# EAGLE board navigator (EAGLE 8.2.0), part 1 of 2
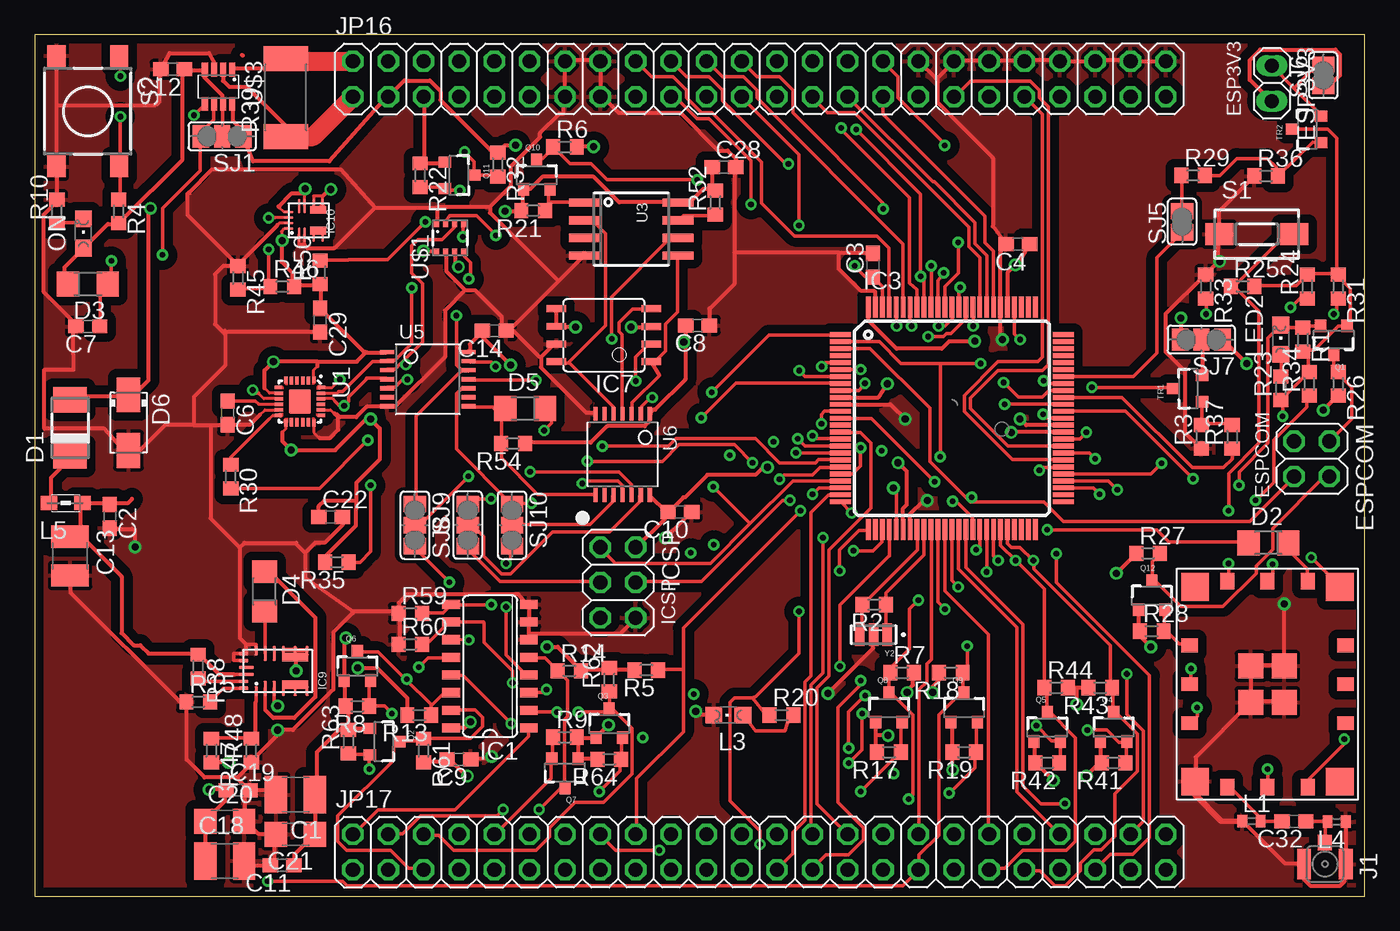
[diagram p2: board, top side]
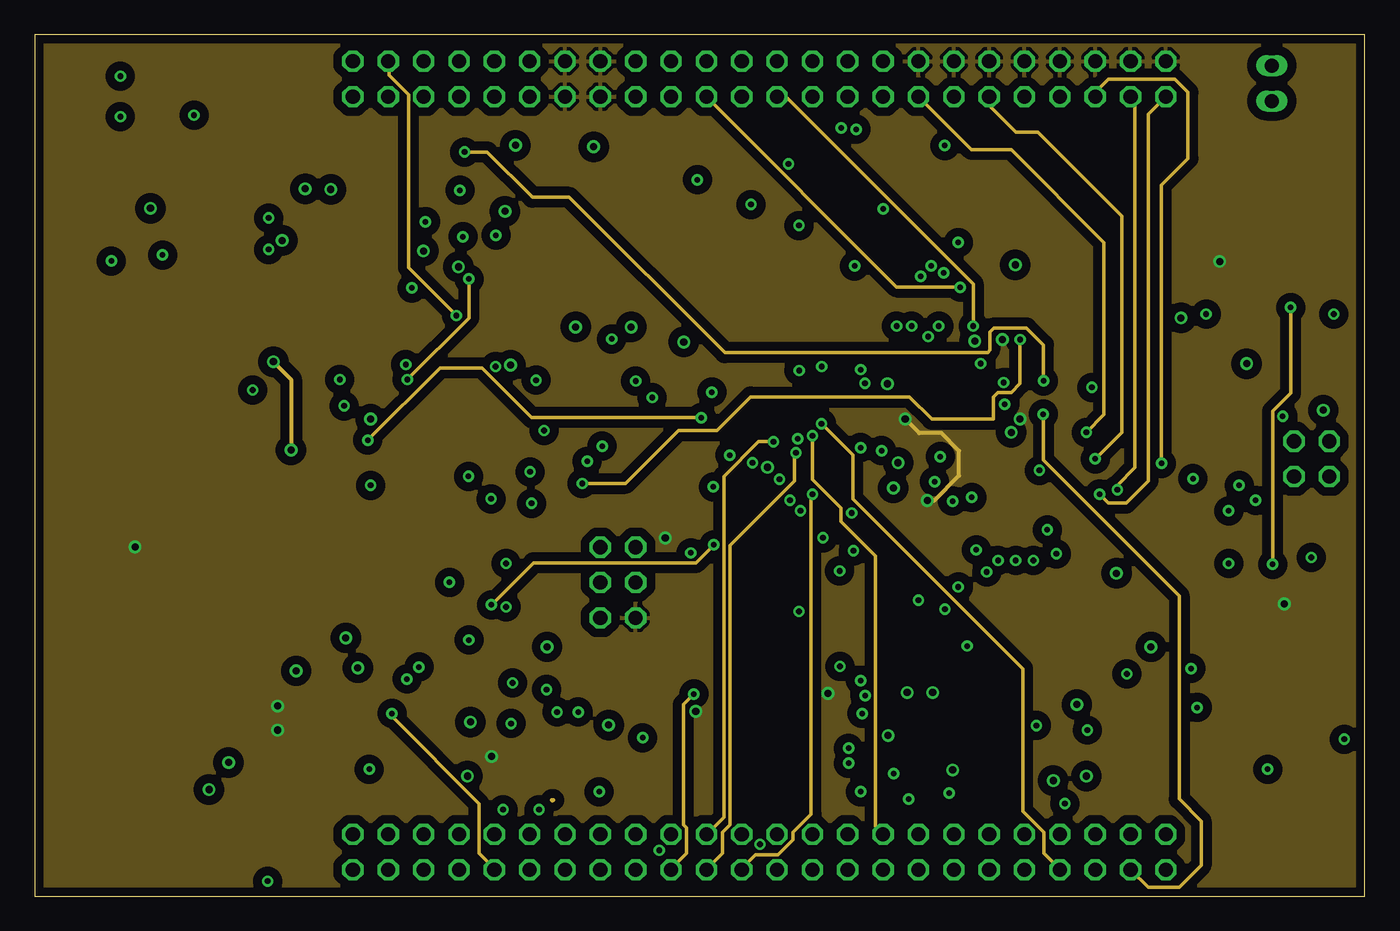
[diagram p3: board, inner layer Route2]
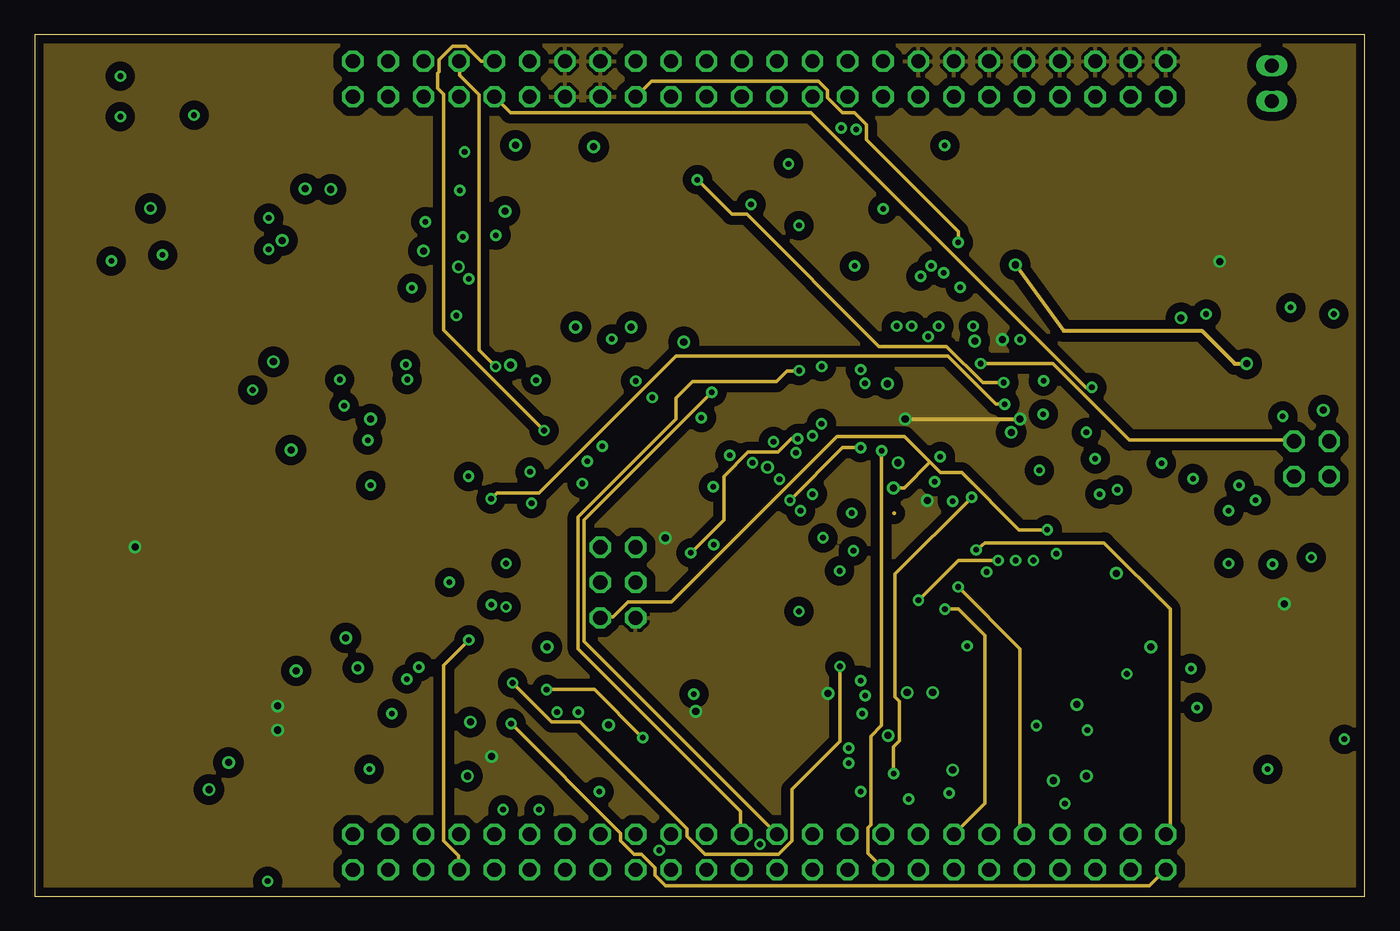
[diagram p4: board, inner layer Route15]
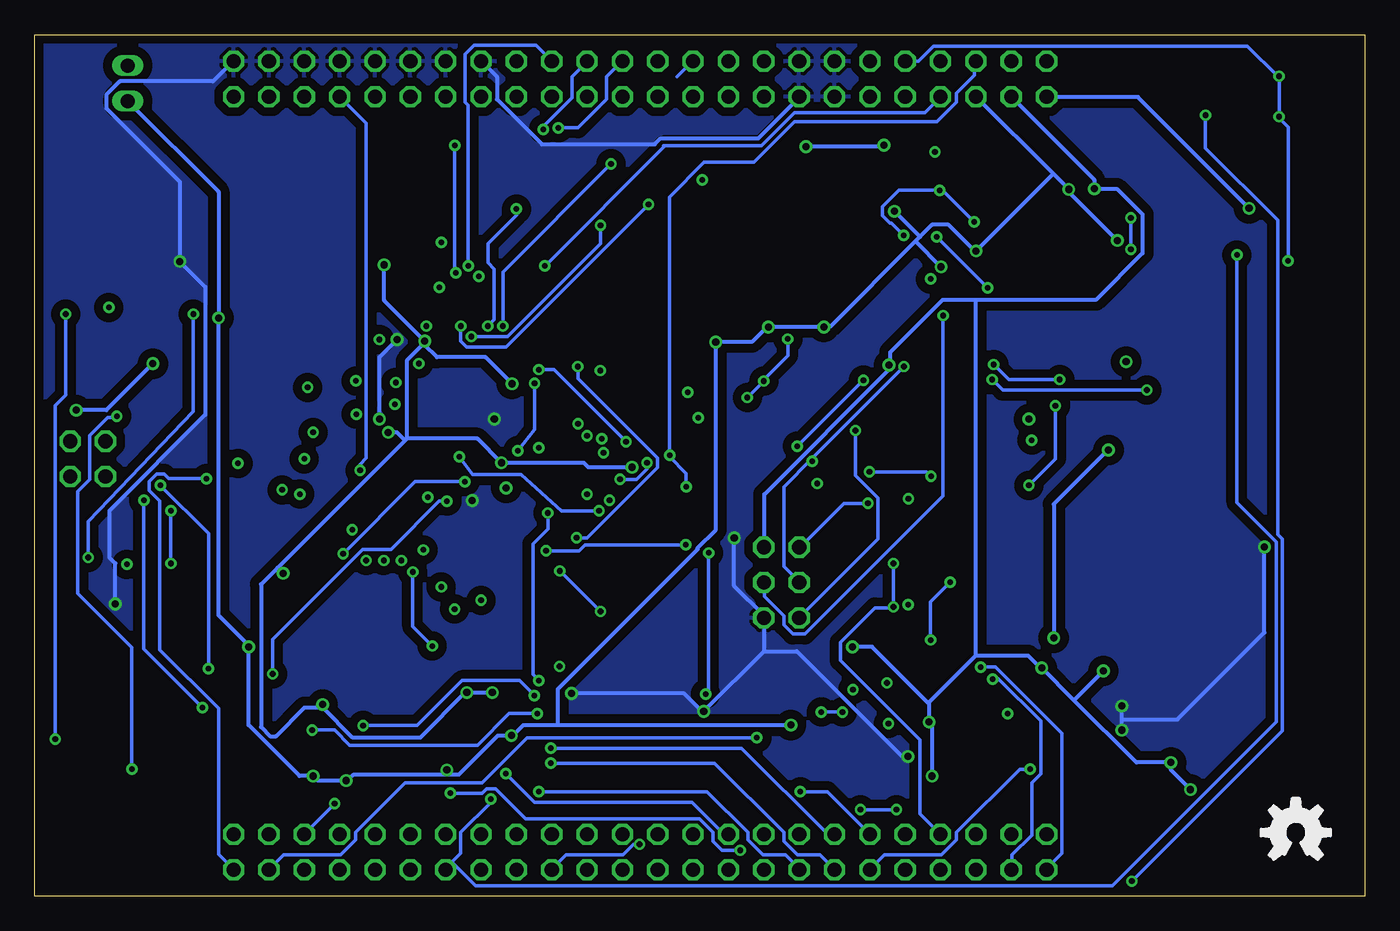
[diagram p5: board, bottom side, seen from below]

Size 95.57 x 61.91 mm. Coordinates in mm from the lower left corner, seen from the top.
Outline: 0,0 95.57,0 95.57,61.91 0,61.91 0,0
Copper layers (1*2*15*16): Top 0.035mm / dielectric 0.5mm / Route2 0.035mm / dielectric 0.5mm / Route15 0.035mm / dielectric 0.5mm / Bottom 0.035mm
Design rules "autorouter *": minimum track width 10mil, minimum drill 16mil, track to track 7mil, track to pad 7mil, pad to pad 8mil, via to via 8mil, smd to smd 8mil, copper to edge 15mil, drill to drill 12mil, minimum pad ring 10mil, minimum via ring 8mil, stop-mask expansion 1mil, vias tented up to drill 30mil, thermal gap 10mil
Net classes: 1 power 5V: width 0.305 mm, drill 0.508 mm, clearance 0.203 mm; 2 power 3.3V: width 0.305 mm, drill 0.508 mm, clearance 0.203 mm; 3 GND: width 0.305 mm, drill 0.508 mm, clearance 0.203 mm; 5 5A: width 1.778 mm, drill 1.168 mm, clearance 0.406 mm

## Footprints (pad centres in the part's own frame; a part is rotated, then mirrored left to right if it is on the bottom)
C1210 = smd 1.6 x 2.7: 1 -1.4,0; 2 1.4,0
C0603 = smd 1.1 x 1: 1 -0.85,0; 2 0.85,0
C1206 = smd 1.6 x 1.8: 1 -1.4,0; 2 1.4,0
DO-214AC = smd 1.8 x 2.4: A 2.025,0; C -2.025,0
R1206 = smd 1.6 x 1.803: 1 -1.422,0; 2 1.422,0
DO214AC = smd 2.5 x 1.7: A 2,0; C -2,0
1X02 = drill 1.016 long: 1 -1.27,0; 2 1.27,0
2X02 = drill 1.016 octagon: 1 -1.27,-1.27; 2 -1.27,1.27; 3 1.27,-1.27; 4 1.27,1.27
SO16 = smd 0.66 x 1.27: 1 -4.445,-2.794; 2 -3.175,-2.794; 3 -1.905,-2.794; 4 -0.635,-2.794; 5 0.635,-2.794; 6 1.905,-2.794; 7 3.175,-2.794; 8 4.445,-2.794; 9 4.445,2.794; 10 3.175,2.794; 11 1.905,2.794; 12 0.635,2.794; 13 -0.635,2.794; 14 -1.905,2.794; 15 -3.175,2.794; 16 -4.445,2.794
TQFP100 = smd 1.5 x 0.35: 1 -8,6; 2 -8,5.5; 3 -8,5; 4 -8,4.5; 5 -8,4; 6 -8,3.5; 7 -8,3; 8 -8,2.5; 9 -8,2; 10 -8,1.5; 11 -8,1; 12 -8,0.5; 13 -8,0; 14 -8,-0.5; 15 -8,-1; 16 -8,-1.5; 17 -8,-2; 18 -8,-2.5; 19 -8,-3; 20 -8,-3.5; 21 -8,-4; 22 -8,-4.5; 23 -8,-5; 24 -8,-5.5; 25 -8,-6; 51 8,-6; 52 8,-5.5; 53 8,-5; 54 8,-4.5; 55 8,-4; 56 8,-3.5; 57 8,-3; 58 8,-2.5; 59 8,-2; 60 8,-1.5; 61 8,-1; 62 8,-0.5; 63 8,0; 64 8,0.5; 65 8,1; 66 8,1.5; 67 8,2; 68 8,2.5; 69 8,3; 70 8,3.5; 71 8,4; 72 8,4.5; 73 8,5; 74 8,5.5; 75 8,6 | smd 0.35 x 1.5: 26 -6,-8; 27 -5.5,-8; 28 -5,-8; 29 -4.5,-8; 30 -4,-8; 31 -3.5,-8; 32 -3,-8; 33 -2.5,-8; 34 -2,-8; 35 -1.5,-8; 36 -1,-8; 37 -0.5,-8; 38 0,-8; 39 0.5,-8; 40 1,-8; 41 1.5,-8; 42 2,-8; 43 2.5,-8; 44 3,-8; 45 3.5,-8; 46 4,-8; 47 4.5,-8; 48 5,-8; 49 5.5,-8; 50 6,-8; 76 6,8; 77 5.5,8; 78 5,8; 79 4.5,8; 80 4,8; 81 3.5,8; 82 3,8; 83 2.5,8; 84 2,8; 85 1.5,8; 86 1,8; 87 0.5,8; 88 0,8; 89 -0.5,8; 90 -1,8; 91 -1.5,8; 92 -2,8; 93 -2.5,8; 94 -3,8; 95 -3.5,8; 96 -4,8; 97 -4.5,8; 98 -5,8; 99 -5.5,8; 100 -6,8
8S2 = smd 0.5 x 1.4: 1 -1.905,-3.404; 2 -0.645,-3.404; 3 0.625,-3.404; 4 1.895,-3.404; 5 1.905,3.404; 6 0.635,3.404; 7 -0.635,3.404; 8 -1.905,3.404
MPM_QFN20 = smd 0.7 x 0.25: 1 -1.45,1.55; 4 -1.45,-0.4; 5 -1.45,-1.25; 6 -1.45,-2.1; 7 1.45,-2.1; 8 1.45,-1.25; 9 1.45,-0.4; 12 1.45,1.55 | smd 1.1 x 0.25: 2 -1.25,0.9; 3 -1.25,0.25; 10 1.25,0.25; 11 1.25,0.9 | smd 0.25 x 0.7: 13 1.25,2.45; 14 0.75,2.45; 17 -0.75,2.45; 18 -1.25,2.45 | smd 0.25 x 1.1: 15 0.25,2.25; 16 -0.25,2.25 | smd 0.6 x 1.95: 19 -1,-1.25; 20 1,-1.25
MPM_QFN12 = smd 1.05 x 0.2: 1 -1.025,0.7; 2 -1.025,0.3; 3 -1.025,-0.35; 4 -1.025,-1; 5 1.025,-1; 6 1.025,-0.35; 7 1.025,0.3; 8 1.025,0.7 | smd 0.2 x 0.7: 9 0.6,1.45; 10 0.2,1.45; 11 -0.2,1.45; 12 -0.6,1.45 | smd 0.55 x 1.2: 13 -0.75,-0.675; 14 0.75,-0.675
2X03 = drill 1.016 octagon: 1 -2.54,-1.27; 2 -2.54,1.27; 3 0,-1.27; 4 0,1.27; 5 2.54,-1.27; 6 2.54,1.27
CON-U.FL = smd 1 x 2.2: GND@0 -1.5,0; GND@1 1.5,0 | smd 1 x 1.1: S 0,-1.55
2X24 = drill 1.016 octagon: 1 -27.94,-1.27; 2 -27.94,1.27; 3 -25.4,-1.27; 4 -25.4,1.27; 5 -22.86,-1.27; 6 -22.86,1.27; 7 -20.32,-1.27; 8 -20.32,1.27; 9 -17.78,-1.27; 10 -17.78,1.27; 11 -15.24,-1.27; 12 -15.24,1.27; 13 -12.7,-1.27; 14 -12.7,1.27; 15 -10.16,-1.27; 16 -10.16,1.27; 17 -7.62,-1.27; 18 -7.62,1.27; 19 -5.08,-1.27; 20 -5.08,1.27; 21 -2.54,-1.27; 22 -2.54,1.27; 23 0,-1.27; 24 0,1.27; 25 2.54,-1.27; 26 2.54,1.27; 27 5.08,-1.27; 28 5.08,1.27; 29 7.62,-1.27; 30 7.62,1.27; 31 10.16,-1.27; 32 10.16,1.27; 33 12.7,-1.27; 34 12.7,1.27; 35 15.24,-1.27; 36 15.24,1.27; 37 17.78,-1.27; 38 17.78,1.27; 39 20.32,-1.27; 40 20.32,1.27; 41 22.86,-1.27; 42 22.86,1.27; 43 25.4,-1.27; 44 25.4,1.27; 45 27.94,-1.27; 46 27.94,1.27; 47 30.48,-1.27; 48 30.48,1.27
R0402 = smd 0.7 x 0.9: 1 -0.65,0; 2 0.65,0
CHIPLED_0805 = smd 1.2 x 1.2: A 0,-1.05; C 0,1.05
0805 = smd 1.2 x 1: 1 -1.2,0; 2 1.2,0
SOT23-3 = smd 0.8 x 0.9: 1 -0.95,-1; 2 0.95,-1; 3 0,1.1
R0603 = smd 1 x 1.1: 1 -0.85,0; 2 0.85,0
R2512 = smd 1.8 x 3.2: 1 -2.8,0; 2 2.8,0
DTSM-3 = smd 2 x 1.6: 1 -2.7,0; 2 2.7,0
DTSM-6 = smd 1.55 x 1.3: 1 -3.975,2.25; 2 3.975,2.25; 3 -3.975,-2.25; 4 3.975,-2.25
SJ_2 = smd 1.168 x 1.6: 1 -1.524,0; 2 0,0; 3 1.524,0
SJ = smd 1.168 x 1.6: 1 -0.762,0; 2 0.762,0
QFN40P300X300X105-25N = smd 0.495 x 0.25: 1 -1.552,1; 6 -1.552,-1; 13 1.552,-1; 18 1.552,1 | smd 0.6 x 0.25: 2 -1.5,0.6; 3 -1.5,0.2; 4 -1.5,-0.2; 5 -1.5,-0.6; 14 1.5,-0.6; 15 1.5,-0.2; 16 1.5,0.2; 17 1.5,0.6 | smd 0.25 x 0.495: 7 -1,-1.552; 12 1,-1.552; 19 1,1.552; 24 -1,1.552 | smd 0.25 x 0.6: 8 -0.6,-1.5; 9 -0.2,-1.5; 10 0.2,-1.5; 11 0.6,-1.5; 20 0.6,1.5; 21 0.2,1.5; 22 -0.2,1.5; 23 -0.6,1.5 | smd 1.75 x 1.6: 25 0,0
SOIC8_200MIL = smd 0.6 x 2.2: 1 -1.905,-3.362; 2 -0.635,-3.362; 3 0.635,-3.362; 4 1.905,-3.362; 5 1.905,3.362; 6 0.635,3.362; 7 -0.635,3.362; 8 -1.905,3.362
TSSOP14 = smd 0.305 x 0.991: 1 -1.95,-2.918; 2 -1.3,-2.918; 3 -0.65,-2.918; 4 0,-2.918; 5 0.65,-2.918; 6 1.3,-2.918; 7 1.95,-2.918; 8 1.95,2.918; 9 1.3,2.918; 10 0.65,2.918; 11 0,2.918; 12 -0.65,2.918; 13 -1.3,2.918; 14 -1.95,2.918
BME280 = smd 0.5 x 0.35: 1 1.025,0.975; 2 1.025,0.325; 3 1.025,-0.325; 4 1.025,-0.975; 5 -1.025,-0.975; 6 -1.025,-0.325; 7 -1.025,0.325; 8 -1.025,0.975
ESP-06 = smd 2 x 2: 1 -7,5.2; 5 -7,-5.2; 9 7,-5.2; 13 7,5.2 | smd 1.2 x 1: 2 -7.4,2.9; 3 -7.4,0; 4 -7.4,-2.9; 10 7.4,-2.9; 11 7.4,0; 12 7.4,2.9 | smd 1 x 1.2: 6 -2.8,-5.6; 7 0,-5.6; 8 2.8,-5.6; 14 2.8,5.6; 15 0,5.6; 16 -2.8,5.6 | smd 1.8 x 1.8: 17 -1.3,1.2; 18 -1.3,-1.2; 19 1.3,-1.2; 20 1.3,1.2
SOT23-8 = smd 1 x 0.45: 1 -1.225,0.975; 2 -1.225,0.325; 3 -1.225,-0.325; 4 -1.225,-0.975; 5 1.225,-0.975; 6 1.225,-0.325; 7 1.225,0.325; 8 1.225,0.975
OSC_CSTCE16M0V53-R0 = smd 0.686 x 1.6: 1 -0.991,0; 2 0,0; 3 0.991,0

## Placement (x,y rotation side)
C1  22uF  [C1210]  18.73,7.3 180 top
C2  100n  [C0603]  5.4,27.3 270 top
C3  100n  [C0603]  60.22,45.35 90 top
C4  100n  [C0603]  70.65,46.86 180 top
C6  100n  [C0603]  13.86,34.73 270 top
C7  22p  [C0603]  3.81,40.96 180 top
C8  100n  [C0603]  47.62,41.02 180 top
C9  100n  [C0603]  30.48,9.84 180 top
C10  100n  [C0603]  46.35,27.62 180 top
C11  100n  [C0603]  17.78,2.22 180 top
C12  100n  [C0603]  9.91,59.44 180 top
C13  22uF  [C1210]  2.54,24.45 270 top
C14  100n  [C0603]  33.02,40.64 180 top
C18  22uF  [C1210]  13.65,2.54 0 top
C19  100n  [C0603]  14.61,7.62 0 top
C20  10uF  [C1206]  13.65,5.4 0 top
C21  10uF  [C1206]  18.73,4.45 180 top
C22  100n  [C0603]  21.26,27.24 0 top
C28  100n  [C0603]  49.53,52.39 0 top
C29  100n  [C0603]  20.51,41.4 270 top
C32  5.6pF  [C0603]  90.49,5.4 180 top
D1  M7  [DO-214AC]  2.54,33.66 90 top
D2  CD1206  [R1206]  88.65,25.4 0 top
D3  CD1206  [R1206]  3.81,44.01 180 top
D4  CD1206  [R1206]  16.51,21.91 270 top
D5  CD1206  [R1206]  35.24,35.04 0 top
D6  SMAJ24CA  [DO214AC]  6.73,34.04 270 top
ESP3V3  [1X02]  88.9,58.42 270 top
ESPCOM  [2X02]  91.76,31.43 270 top
IC1  74HC4052D  [SO16]  32.72,16.54 90 top
IC3  ATMEGA2560-16AU  [TQFP100]  65.9,34.35 0 top
IC7  AT45DB161E-SHD-B  [8S2]  40.89,40.32 90 top
IC9  MPM3610  [MPM_QFN20]  17.46,16.19 90 top
IC10  MPM3810  [MPM_QFN12]  19.68,48.58 90 top
ICSP  ISP  [2X03]  41.91,22.54 270 top
J1  U.FL  [CON-U.FL]  92.71,2.31 180 top
JP16  [2X24]  50.8,58.74 0 top
JP17  [2X24]  50.8,3.17 0 top
L1  N/A  [R0402]  87.42,5.4 0 top
L3  YELLOW  [CHIPLED_0805]  49.85,13.02 90 top
L4  N/A  [R0402]  93.55,5.35 180 top
L5  74279206  [0805]  2.22,28.26 0 top
LED2  BLUE  [CHIPLED_0805]  89.53,40.01 0 top
ON  GREEN  [CHIPLED_0805]  3.49,47.62 0 top
Q1  BSS138  [SOT23-3]  93.34,40.01 180 top
Q2  BSS138  [SOT23-3]  25.08,11.11 270 top
Q3  BSS138  [SOT23-3]  41.27,12.38 0 top
Q4  BSS138  [SOT23-3]  77.52,12.12 0 top
Q5  BSS138  [SOT23-3]  72.76,12.12 0 top
Q6  BSS138  [SOT23-3]  23.18,16.51 0 top
Q7  BSS138  [SOT23-3]  38.1,8.89 180 top
Q8  BSS138  [SOT23-3]  61.38,13.52 0 top
Q9  BSS138  [SOT23-3]  66.78,13.52 0 top
Q10  BSS138  [SOT23-3]  36.07,51.82 0 top
Q11  BSS138  [SOT23-3]  30.48,51.82 270 top
Q12  BSS138  [SOT23-3]  80.26,21.59 0 top
R1  10K  [R0603]  91.12,40.01 270 top
R2  1M  [R0603]  60.33,20.95 180 top
R3  10K  [R0603]  83.82,33.02 90 top
R4  10K  [R0603]  6.03,49.21 270 top
R5  10K  [R0603]  43.94,16.26 180 top
R6  10K  [R0603]  38.1,53.85 0 top
R7  4K7  [R0603]  62.33,16.06 0 top
R8  10K  [R0603]  23.18,13.65 180 top
R9  10K  [R0603]  38.1,11.43 0 top
R10  4K7  [R0603]  1.59,49.21 90 top
R13  10K  [R0603]  27.62,13.02 180 top
R14  10K  [R0603]  38.42,16.19 0 top
R15  56K  [R0603]  11.75,13.97 0 top
R17  4K7  [R0603]  61.38,10.35 180 top
R18  4K7  [R0603]  65.83,16.06 180 top
R19  4K7  [R0603]  66.78,10.35 180 top
R20  4K7  [R0603]  53.66,13.02 0 top
R21  10K  [R0603]  35.81,49.28 180 top
R22  10K  [R0603]  27.69,51.82 270 top
R23  4K7  [R0603]  89.53,36.51 90 top
R24  10K  [R0603]  91.44,43.81 90 top
R25  10K  [R0603]  86.79,43.83 0 top
R26  10K  [R0603]  93.66,36.83 270 top
R27  10K  [R0603]  80.01,24.64 0 top
R28  10K  [R0603]  80.26,19.05 0 top
R29  100R  [R0603]  83.24,51.8 0 top
R30  220  [R0603]  14.08,30.16 270 top
R31  10K  [R0603]  93.66,43.81 270 top
R32  10K  [R0603]  33.27,52.58 270 top
R33  10K  [R0603]  84.14,43.81 270 top
R34  10K  [R0603]  91.58,36.82 90 top
R35  10K  [R0603]  21.7,24 180 top
R36  10K  [R0603]  88.48,51.77 0 top
R37  100R  [R0603]  86.04,33.02 90 top
R38  100K  [R0603]  11.75,16.51 270 top
R39  0.01/1%  [R2512]  18.03,57.4 90 top
R41  10K  [R0603]  77.52,9.58 180 top
R42  10K  [R0603]  72.76,9.58 180 top
R43  10K  [R0603]  76.57,14.98 180 top
R44  10K  [R0603]  73.39,14.98 0 top
R45  22K/1%  [R0603]  14.61,44.45 270 top
R46  100K/1%  [R0603]  17.78,43.81 0 top
R47  100K/1%  [R0603]  12.7,10.48 270 top
R48  19.1K/1%  [R0603]  15.56,10.48 90 top
R50  10K  [R0603]  20.51,44.83 90 top
R52  10K  [R0603]  48.9,49.85 90 top
R54  10K  [R0603]  34.37,32.54 180 top
R59  10K  [R0603]  26.99,20.32 0 top
R60  10K  [R0603]  26.99,18.1 0 top
R61  10K  [R0603]  27.94,10.48 270 top
R62  10K  [R0603]  41.27,15.56 90 top
R63  10K  [R0603]  22.54,11.11 90 top
R64  10K  [R0603]  41.27,9.84 180 top
S1  DTSM-3  [DTSM-3]  87.81,47.59 0 top
S2  DTSM-6  [DTSM-6]  3.81,56.41 270 top
SJ1  [SJ_2]  13.46,54.61 180 top
SJ5  [SJ]  82.45,48.48 90 top
SJ6  [SJ]  92.6,58.99 90 top
SJ7  [SJ_2]  83.82,40.01 180 top
SJ8  [SJ_2]  31.11,26.67 90 top
SJ9  [SJ_2]  27.3,26.67 270 top
SJ10  [SJ_2]  34.29,26.67 270 top
TR1  PMV48XP  [SOT23-3]  82.89,36.49 90 top
TR2  PMV48XP  [SOT23-3]  91.44,55.12 90 top
U1  MPU-9250  [QFN40P300X300X105-25N]  19.05,35.56 270 top
U3  [SOIC8_200MIL]  42.86,47.94 270 top
U5  TXB0104PWR  [TSSOP14]  28.24,37.16 270 top
U6  TXB0104PWR  [TSSOP14]  42.24,31.75 180 top
U$1  BME280  [BME280]  29.84,47.32 90 top
U$2  ESP-06  [ESP-06]  88.58,15.24 90 top
U$3  INA219-SOT23-8  [SOT23-8]  13.21,58.17 270 top
U$4  OSHW  [OSHWM]  4.95,4.57 0 top
Y2  CSTCE16M0V53-R0  [OSC_CSTCE16M0V53-R0]  60.27,18.8 180 top